# EAGLE design Coax_Encoder (EAGLE 9.5.2)
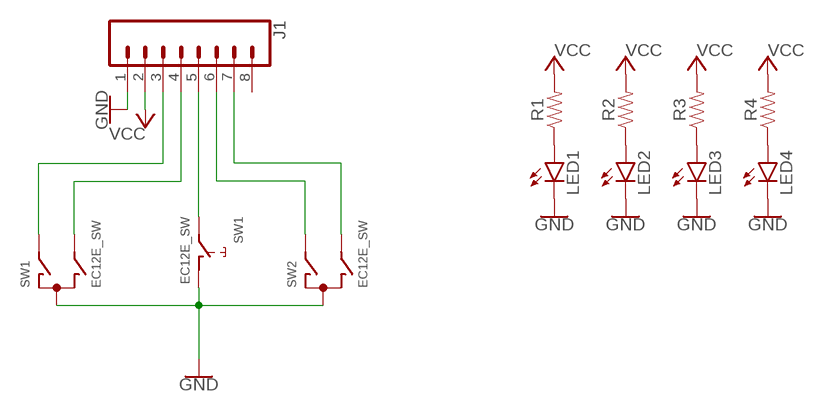
[diagram p0: schematic, sheet 1]

## Parts
J1  CONN_08"  [1X08]
LED1  LED3MM  [LED3MM]
LED2  LED3MM  [LED3MM]
LED3  LED3MM  [LED3MM]
LED4  LED3MM  [LED3MM]
R1  RESISTOR1206  [1206]
R2  RESISTOR1206  [1206]
R3  RESISTOR1206  [1206]
R4  RESISTOR1206  [1206]
SW1  EC12E_SW  [ALPS_EC12E_SW]
SW2  EC12E_SW  [ALPS_EC12E_SW]

## Nets
GND: J1.1 LED1.K(C) LED2.K(C) LED3.K(C) LED4.K(C) SW1.C SW1.D SW2.C
N$1: J1.3 SW1.A
N$2: J1.4 SW1.B
N$3: J1.5 SW1.E
N$4: J1.6 SW2.A
N$5: J1.7 SW2.B
N$6: LED1.A R1.1
N$7: LED2.A R2.1
N$8: LED3.A R3.1
N$9: LED4.A R4.1
VCC: J1.2 R1.2 R2.2 R3.2 R4.2
Unconnected: J1.8 SW1.GND1(G) SW1.GND2(G) SW2.D SW2.E SW2.GND1(G) SW2.GND2(G)

## Library data of the parts
J1 = SparkFun-Connectors:CONN_08: Multi connection point. Often used as Generic Header-pin footprint for 0.1 inch spaced/style header connections On any of the 0.1 inch spaced packages, you can populate with these: Break Away Headers - Straight <https://www.sparkfun.com/products/116> (PRT-00116) Break Away Male Headers - Right Angle <https://www.sparkfun.com/products/553> (PRT-00553) Female Headers <https://www.sparkfun.com/products/115> (PRT-00115) Break Away Headers - Machine Pin <https://www.sparkfun.com/products/117> (PRT-00117) Break Away Female Headers - Swiss Machine Pin <https://www.sparkfun.com/products/743> (PRT-00743) Arduino Stackable Header - 8 Pin <https://www.sparkfun.com/products/9279> (PRT-09279) For SCREWTERMINALS and SPRING TERMINALS visit here: Screw Terimnals on SparkFun.com <https://www.sparkfun.com/search/results?term=Screw+Terminals> (5mm/3.5mm/2.54mm spacing) This device is also useful as a general connection point to wire up your design to another part of your project. Our various solder wires solder well into these plated through hole pads. Hook-Up Wire - Assortment (Stranded, 22 AWG) <https://www.sparkfun.com/products/11375> (PRT-11375) Hook-Up Wire - Assortment (Solid Core, 22 AWG) <https://www.sparkfun.com/products/11367> (PRT-11367) View the entire wire category on our website here <https://www.sparkfun.com/categories/141> Special notes: Molex polarized connector foot print use with SKU : PRT-08231 with associated crimp pins and housings. 1MM SMD Version SKU: PRT-10208 NOTES ON THE VARIANTS LOCK and LOCK_LONGPADS... This footprint was designed to help hold the alignment of a through-hole component (i.e. 6-pin header) while soldering it into place. You may notice that each hole has been shifted either up or down by 0.005 of an inch from it's more standard position (which is a perfectly straight line). This slight alteration caused the pins (the squares in the middle) to touch the edges of the holes. Because they are alternating, it causes a "brace" to hold the component in place. 0.005 has proven to be the perfect amount of "off-center" position when using our standard breakaway headers. Although looks a little odd when you look at the bare footprint, once you have a header in there, the alteration is very hard to notice. Also,if you push a header all the way into place, it is covered up entirely on the bottom side.; PROD_ID: CONN-08438
LED1-LED4 = led:LED: LED OSRAM: - CHIPLED LG R971, LG N971, LY N971, LG Q971, LY Q971, LO R971, LY R971 LH N974, LH R974 LS Q976, LO Q976, LY Q976 LO Q996 - Hyper CHIPLED LW Q18S LB Q993, LB Q99A, LB R99A - SideLED LS A670, LO A670, LY A670, LG A670, LP A670 LB A673, LV A673, LT A673, LW A673 LH A674 LY A675 LS A676, LA A676, LO A676, LY A676, LW A676 LS A679, LY A679, LG A679 - Hyper Micro SIDELED® LS Y876, LA Y876, LO Y876, LY Y876 LT Y87S - SmartLED LW L88C, LW L88S LB L89C, LB L89S, LG L890 LS L89K, LO L89K, LY L89K LS L896, LA L896, LO L896, LY L896 - TOPLED LS T670, LO T670, LY T670, LG T670, LP T670 LSG T670, LSP T670, LSY T670, LOP T670, LYG T670 LG T671, LOG T671, LSG T671 LB T673, LV T673, LT T673, LW T673 LH T674 LS T676, LA T676, LO T676, LY T676, LB T676, LH T676, LSB T676, LW T676 LB T67C, LV T67C, LT T67C, LS T67K, LO T67K, LY T67K, LW E67C LS E67B, LA E67B, LO E67B, LY E67B, LB E67C, LV E67C, LT E67C LW T67C LS T679, LY T679, LG T679 LS T770, LO T770, LY T770, LG T770, LP T770 LB T773, LV T773, LT T773, LW T773 LH T774 LS E675, LA E675, LY E675, LS T675 LS T776, LA T776, LO T776, LY T776, LB T776 LHGB T686 LT T68C, LB T68C - Hyper Mini TOPLED® LB M676 - Mini TOPLED Santana® LG M470 LS M47K, LO M47K, LY M47K Source: http://www.osram.convergy.de LUXEON: - LUMILED® LXK2-PW12-R00, LXK2-PW12-S00, LXK2-PW14-U00, LXK2-PW14-V00 LXK2-PM12-R00, LXK2-PM12-S00, LXK2-PM14-U00 LXK2-PE12-Q00, LXK2-PE12-R00, LXK2-PE12-S00, LXK2-PE14-T00, LXK2-PE14-U00 LXK2-PB12-K00, LXK2-PB12-L00, LXK2-PB12-M00, LXK2-PB14-N00, LXK2-PB14-P00, LXK2-PB14-Q00 LXK2-PR12-L00, LXK2-PR12-M00, LXK2-PR14-Q00, LXK2-PR14-R00 LXK2-PD12-Q00, LXK2-PD12-R00, LXK2-PD12-S00 LXK2-PH12-R00, LXK2-PH12-S00 LXK2-PL12-P00, LXK2-PL12-Q00, LXK2-PL12-R00 Source: www.luxeon.com KINGBRIGHT: KA-3528ASYC Source: www.kingbright.com
R1-R4 = SparkFun-Resistors:RESISTOR: Generic Resistor Package
SW1 SW2 = switch-alps:EC12E_SW: ALPS rotary Encoder EC12E series with switch; MPN: EC12E2424407; OC_FARNELL: 1520813; OC_NEWARK: 74M1068

## Board
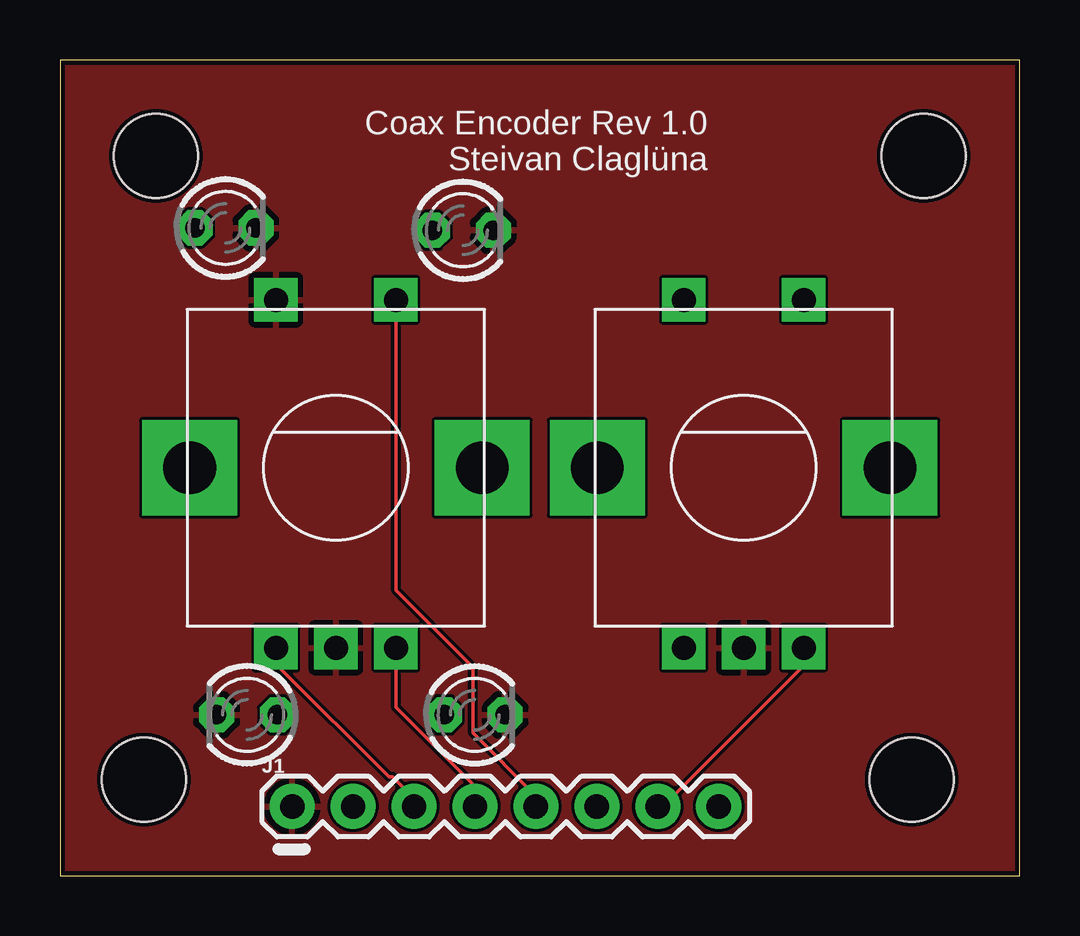
[diagram p1: board, top side]
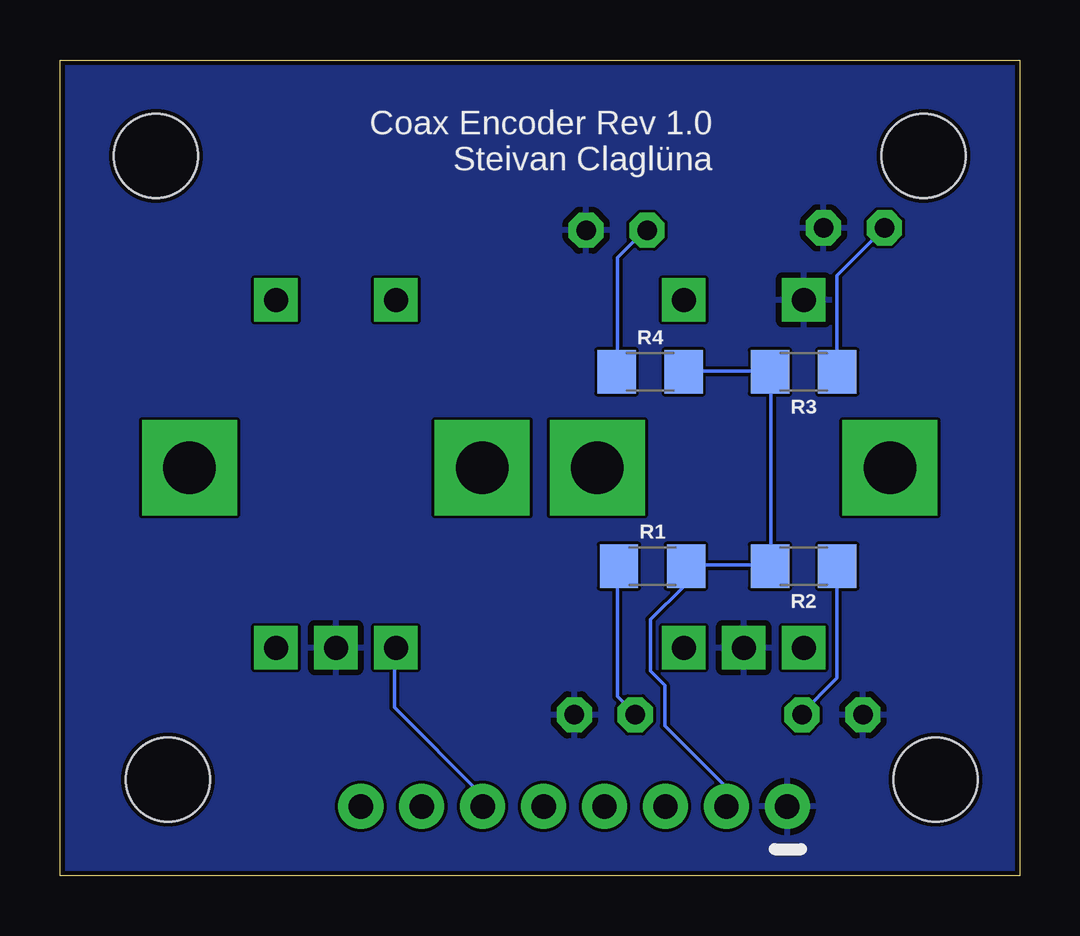
[diagram p2: board, bottom side, seen from below]

Size 40 x 34 mm. Coordinates in mm from the lower left corner, seen from the top.
Outline: 0,0 40,0 40,34 0,34 0,0
Copper layers (1*16): Top 0.035mm / dielectric 1.6mm / Bottom 0.035mm
Design rules "jlcpcb-2layers": minimum track width 5mil, minimum drill 0.3mm, track to track 5mil, track to pad 5mil, pad to pad 5mil, via to via 5mil, smd to smd 5mil, copper to edge 0.2mm, drill to drill 6mil, minimum pad ring 10mil, minimum via ring 3mil, stop-mask expansion 4mil, vias tented up to drill 0mil, thermal gap 10mil
Holes 3.5 mm at 4,30 3.5,4 36,30 35.5,4

### Footprints (pad centres in the part's own frame; a part is rotated, then mirrored left to right if it is on the bottom)
1X08 = drill 1.016 pad 1.88: 1 0,0; 2 2.54,0; 3 5.08,0; 4 7.62,0; 5 10.16,0; 6 12.7,0; 7 15.24,0; 8 17.78,0
LED3MM = drill 0.813 octagon: A -1.27,0; K 1.27,0
1206 = smd 1.6 x 1.8: 1 -1.4,0; 2 1.4,0
ALPS_EC12E_SW = drill 1 square: A -2.5,-7.5; B 2.5,-7.5; C 0,-7.5; D -2.5,7; E 2.5,7 | drill 2.2 square: GND1 -6.1,0; GND2 6.1,0

### Placement (x,y rotation side)
J1  9.68,2.88 0 top
LED1  17.29,6.7 0 top
LED2  7.8,6.7 180 top
LED3  6.9,27 0 top
LED4  16.8,26.9 0 top
R1  15.3,12.9 0 bottom
R2  9,12.9 180 bottom
R3  9,21 180 bottom
R4  15.4,21 0 bottom
SW1  11.5,17 0 top
SW2  28.5,17 0 top

### Tracks (layer width: path | path; a pad name or v marks a point on that pad's centre or on a via)
GND
  pour Top: -0.7,30.3 -0.7,-0.8 -0.5,-1 40.1,-1 41.1,0 41.1,33.2 40.4,33.9 -0.1,33.9
  pour Bottom: -0.9,30.3 -0.9,-1 -0.5,-1.4 39.7,-1.4 41.1,0 41.1,34.3 0.1,34.3
N$1
  Top 0.152: SW1.A 9.14,9.45 9.14,8.69 13.72,4.12 13.87,4.12 14.63,3.35 14.63,2.9 J1.3
N$2
  Top 0.152: SW1.B 14.02,9.45 14.02,7.01 17.22,3.81 17.22,2.9 J1.4
N$3
  Top 0.152: SW1.E 14.02,23.93 14.02,11.89 17.22,8.69 17.22,5.94 19.81,3.35 19.81,2.9 J1.5
N$4
  Bottom 0.152: SW2.A 26.06,9.45 26.06,7.01 22.4,3.35 22.4,2.9 J1.6
N$5
  Top 0.152: SW2.B 30.94,9.45 30.94,8.69 24.99,2.74 J1.7
N$6
  Bottom 0.152: R1.1 16.76,12.8 16.76,7.47 16,6.71 LED1.A
N$7
  Bottom 0.152: R2.1 7.62,12.8 7.62,8.23 9.14,6.71 LED2.A
N$8
  Bottom 0.152: LED3.A 7.62,25.01 7.62,21.03 R3.1
N$9
  Bottom 0.152: R4.1 16.76,21.03 16.76,25.76 15.54,26.98 LED4.A
VCC
  Bottom 0.152: R4.2 13.87,21.03 10.52,21.03 R3.2 10.36,20.88 10.36,12.95 R2.2 10.52,12.95 13.87,12.95 R1.2 14.02,12.8 14.02,12.04 15.39,10.67 15.39,8.53 14.78,7.92 14.78,6.25 12.34,3.81 12.34,2.9 J1.2

### Text on the board
tNames: Coax Encoder Rev 1.0 / Steivan Claglüna
bNames: Coax Encoder Rev 1.0 / Steivan Claglüna